# EAGLE schematic temperature_sensor (EAGLE 9.2.2)
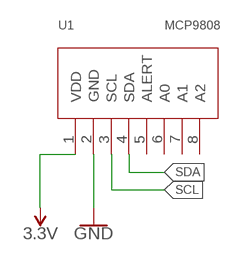
[diagram p0: schematic, sheet 1]

## Parts
U1  MCP9808  [MCP9808]

## Nets
3.3V: U1.1(VDD)
GND: U1.2(GND)
SCL: U1.3(SCL)
SDA: U1.4(SDA)
Unconnected: U1.5(ALERT) U1.6(A0) U1.7(A1) U1.8(A2)

## Library data of the parts
U1 = MCP9808:MCP9808